# EAGLE schematic PicoBoard (EAGLE 6.5.0)
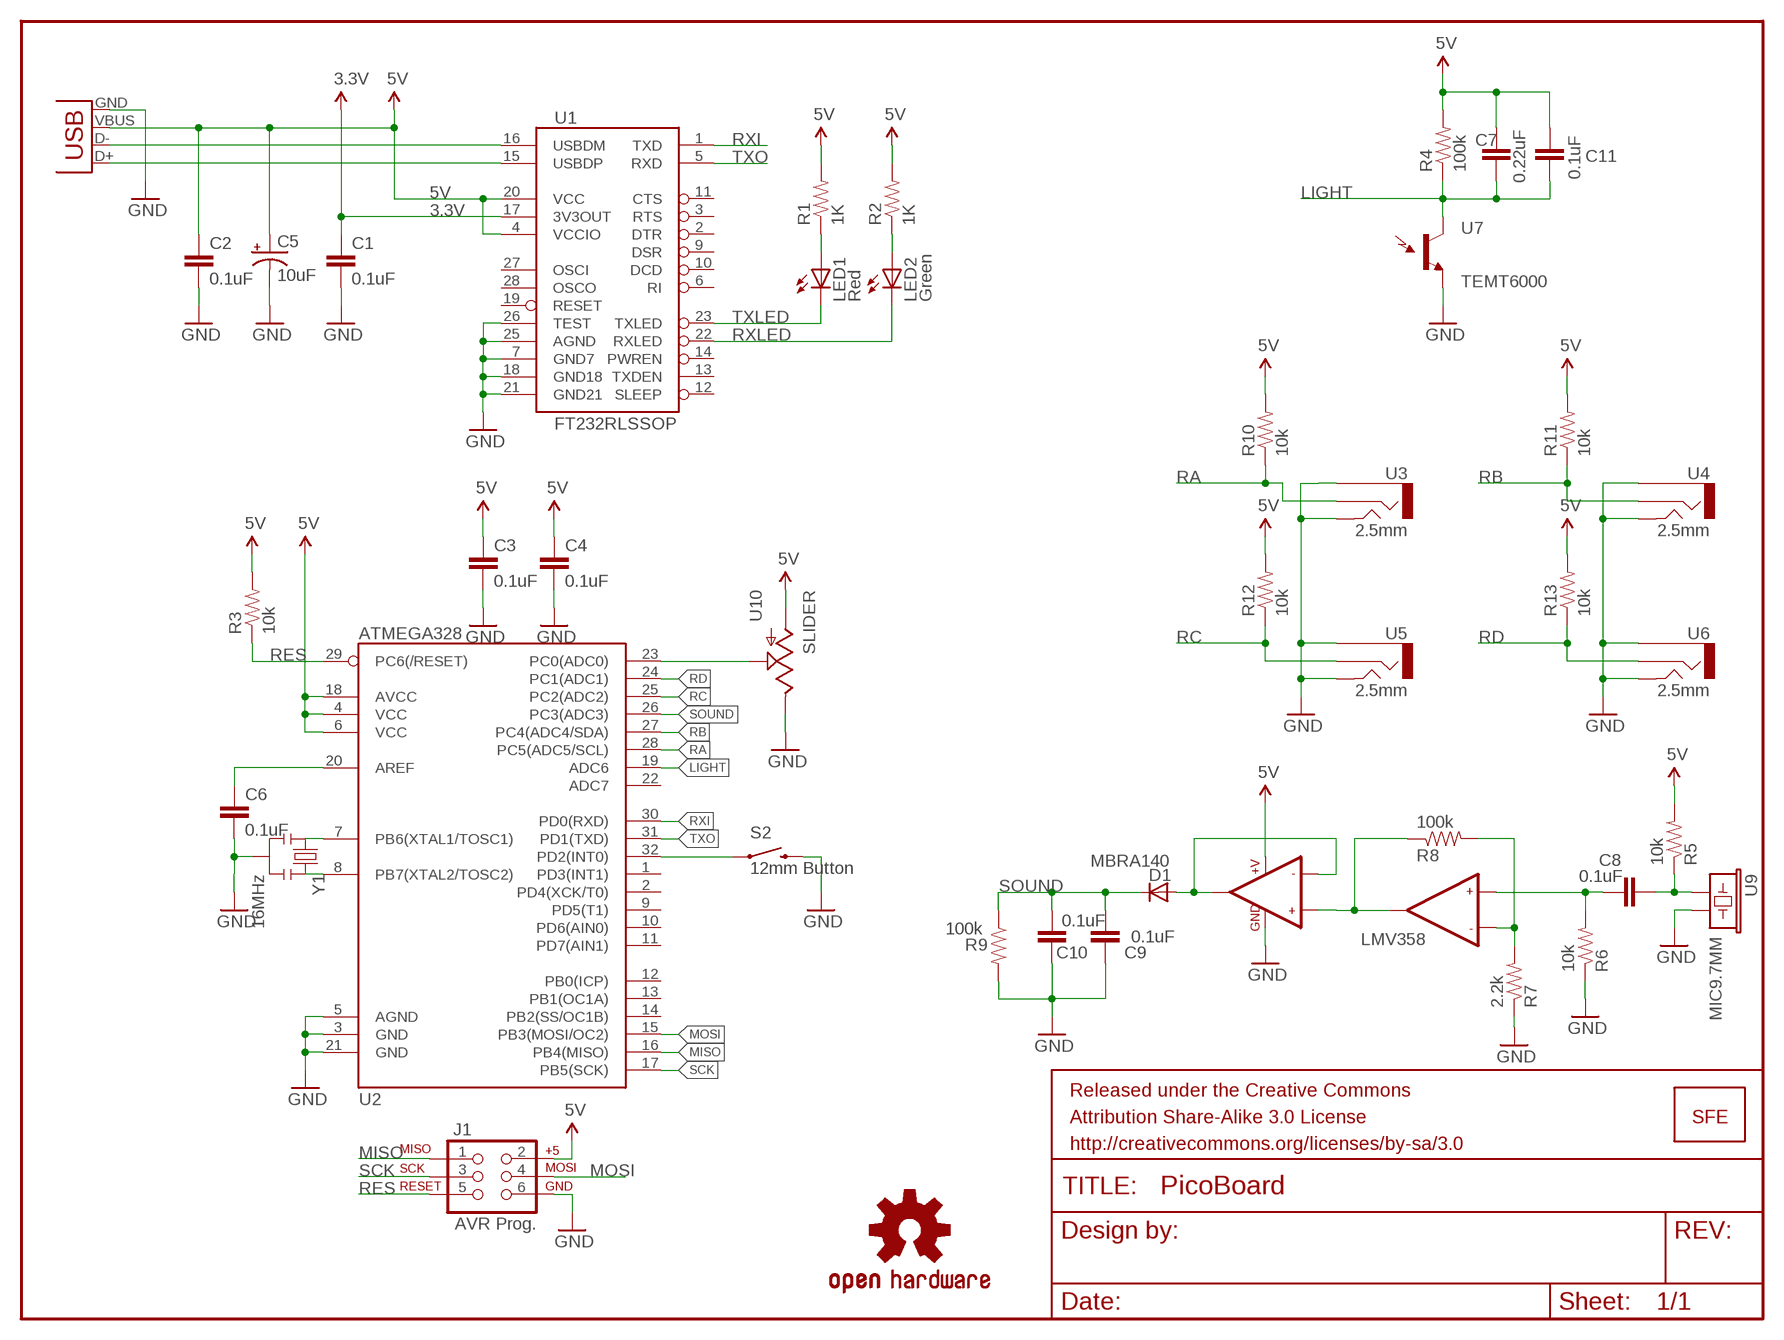
[diagram p0: schematic, sheet 1]

## Parts
C1  0.1uF  CAP0603-CAP  [0603-CAP]
C2  0.1uF  CAP0603-CAP  [0603-CAP]
C3  0.1uF  CAP0603-CAP  [0603-CAP]
C4  0.1uF  CAP0603-CAP  [0603-CAP]
C5  10uF  CAP_POL1206  [EIA3216]
C6  0.1uF  CAP0603-CAP  [0603-CAP]
C7  0.22uF  CAP0603-CAP  [0603-CAP]
C8  0.1uF  CAP0603-CAP  [0603-CAP]
C9  0.1uF  CAP0603-CAP  [0603-CAP]
C10  0.1uF  CAP0603-CAP  [0603-CAP]
C11  0.1uF  CAP0603-CAP  [0603-CAP]
D1  MBRA140  DIODESMA  [SMA-DIODE]
FRAME1  FRAME-LETTER  [CREATIVE_COMMONS]
J1  AVR Prog.  AVR_SPI_PRG_6PTH  [2X3]
JP1  LOGO-SFENEW  [SFE-NEW-WEBLOGO]
LED1  Red  LED0603  [LED-0603]
LED2  Green  LED0603  [LED-0603]
LOGO1  OSHW-LOGOL  [OSHW-LOGO-L]
R1  1K  RESISTOR0603-RES  [0603-RES]
R2  1K  RESISTOR0603-RES  [0603-RES]
R3  10k  RESISTOR0603-RES  [0603-RES]
R4  100k  RESISTOR0603-RES  [0603-RES]
R5  10k  RESISTOR0603-RES  [0603-RES]
R6  10k  RESISTOR0603-RES  [0603-RES]
R7  2.2k  RESISTOR0603-RES  [0603-RES]
R8  100k  RESISTOR0603-RES  [0603-RES]
R9  100k  RESISTOR0603-RES  [0603-RES]
R10  10k  RESISTOR0603-RES  [0603-RES]
R11  10k  RESISTOR0603-RES  [0603-RES]
R12  10k  RESISTOR0603-RES  [0603-RES]
R13  10k  RESISTOR0603-RES  [0603-RES]
S2  12mm Button  SWITCH-MOMENTARY-212MM  [TACTILE-PTH-12MM]
U1  FT232RLSSOP  [SSOP28DB]
U2  ATMEGA328  ATMEGA168  [TQFP32-08]
U3  2.5mm  AUDIO-JACKSMD  [STEREOJACK2.5MM_SMD]
U4  2.5mm  AUDIO-JACKSMD  [STEREOJACK2.5MM_SMD]
U5  2.5mm  AUDIO-JACKSMD  [STEREOJACK2.5MM_SMD]
U6  2.5mm  AUDIO-JACKSMD  [STEREOJACK2.5MM_SMD]
U7  TEMT6000  [TEMT6000-SEN]
U8  LMV358  [SO08]
U9  MIC9.7MM  [MIC-9.7MM]
U10  SLIDER  [SLIDER]
X1  USBSMD  [USB-MINIB]
Y1  16MHz  RESONATORSMD  [RESONATOR-SMD]

## Nets
3.3V [power]: C1.1 U1.17(3V3OUT)
5V: C2.1 C3.1 C4.1 C5.A(+) C7.1 C11.1 J1.2 R1.2 R2.2 R3.2 R4.2 R5.2 R10.2 R11.2 R12.2 R13.2 U1.4(VCCIO) U1.20(VCC) U2.4(VCC) U2.6(VCC) U2.18(AVCC) U8.8(+V) U10.3(A) X1.VBUS
GND [power]: C1.2 C2.2 C3.2 C4.2 C5.C(-) C6.2 C9.1 C10.1 J1.6 R6.1 R7.1 R9.2 S2.3 U1.7(GND7) U1.18(GND18) U1.21(GND21) U1.25(AGND) U1.26(TEST) U2.3(GND) U2.5(AGND) U2.21(GND) U3.1 U3.5 U4.1 U4.5 U5.1 U5.5 U6.1 U6.5 U7.EMITTER(E1) U8.4(GND) U9.2 U10.1(E) X1.GND Y1.2
LIGHT: C7.2 C11.2 R4.1 U2.19(ADC6) U7.COLLECTOR(C1)
MISO: J1.1 U2.16(PB4(MISO))
MOSI: J1.4 U2.15(PB3(MOSI/OC2))
N$1: LED1.A R1.1
N$2: LED2.A R2.1
N$3: R7.2 R8.2 U8.6(-IN2)
N$5: U2.7(PB6(XTAL1/TOSC1)) Y1.1
N$6: U2.8(PB7(XTAL2/TOSC2)) Y1.3
N$7: C6.1 U2.20(AREF)
N$8: S2.1 U2.32(PD2(INT0))
N$9: C8.1 R5.1 U9.1
N$10: U2.23(PC0(ADC0)) U10.2A(S)
N$11: C8.2 R6.2 U8.5(+IN2)
N$13: D1.A U8.1(OUT1) U8.2(-IN1)
N$16: R8.1 U8.3(+IN1) U8.7(OUT2)
RA: R10.1 U2.28(PC5(ADC5/SCL)) U3.4
RB: R11.1 U2.27(PC4(ADC4/SDA)) U4.4
RC: R12.1 U2.25(PC2(ADC2)) U5.4
RD: R13.1 U2.24(PC1(ADC1)) U6.4
RES: J1.5 R3.1 U2.29(PC6(/RESET))
RXI: U1.1(TXD) U2.30(PD0(RXD))
RXLED: LED2.C U1.22(RXLED)
SCK: J1.3 U2.17(PB5(SCK))
SOUND: C9.2 C10.2 D1.C R9.1 U2.26(PC3(ADC3))
TXLED: LED1.C U1.23(TXLED)
TXO: U1.5(RXD) U2.31(PD1(TXD))
USB_D+: U1.15(USBDP) X1.D+
USB_D-: U1.16(USBDM) X1.D-
Unconnected: U1.2(DTR) U1.3(RTS) U1.6(RI) U1.9(DSR) U1.10(DCD) U1.11(CTS) U1.12(SLEEP) U1.13(TXDEN) U1.14(PWREN) U1.19(RESET) U1.27(OSCI) U1.28(OSCO) U2.1(PD3(INT1)) U2.2(PD4(XCK/T0)) U2.9(PD5(T1)) U2.10(PD6(AIN0)) U2.11(PD7(AIN1)) U2.12(PB0(ICP)) U2.13(PB1(OC1A)) U2.14(PB2(SS/OC1B)) U2.22(ADC7)

## Notes on the sheet
- LMV358

## Library data of the parts
C1-C4 C6-C11 = SparkFun:CAP: Capacitor Standard 0603 ceramic capacitor, and 0.1" leaded capacitor.
C5 = SparkFun:CAP_POL: Capacitor Polarized These are standard SMD and PTH capacitors. Normally 10uF, 47uF, and 100uF in electrolytic and tantalum varieties. Always verify the external diameter of the through hole cap, it varies with capacity, voltage, and manufacturer. The EIA devices should be standard.
D1 = SparkFun:DIODE: Diode These are standard reverse protection diodes and small signal diodes. SMA package can handle up to about 1A. SOD-323 can handle about 200mA. What the SOD-323 package when ordering, there are some mfgs out there that are 5-pin packages.
FRAME1 = SparkFun-Aesthetics:FRAME-LETTER: Schematic Frame Standard 8.5x11 US Letter frame
J1 = SparkFun:AVR_SPI_PRG_6: AVR ISP 6 Pin This is the reduced ISP connector for AVR programming. Common on Arduino. This footprint will take up less PCB space and can be used with a 10-pin to 6-pin adapter such as SKU: BOB-08508
JP1 = SparkFun:LOGO-SFE: Spark Fun Electronics PCB Logo This is the standard Spark Fun Electronics PCB logo.
LED1 LED2 = SparkFun:LED: LEDs Standard schematic elements and footprints for 5mm, 3mm, 1206, and 0603 sized LEDs. 5mm - Spark Fun Electronics SKU : COM-00529 (and others)
LOGO1 = SparkFun-Aesthetics:OSHW-LOGO: Open Source Hardware Logo This logo indicates the piece of hardware it is found on incorporates a OSHW license and/or adheres to the definition of open source hardware found here: http://freedomdefined.org/OSHW
R1-R13 = SparkFun:RESISTOR: Resistor Basic schematic elements and footprints for 0603, 1206, and PTH resistors.
S2 = SparkFun:SWITCH-MOMENTARY-2
U1 = SparkFun:FT232RL: USB UART FT232RL 4th Generation USB UART (USB <-> Serial) Controller. Spark Fun Electronics SKU : COM-00650
U2 = SparkFun:ATMEGA168
U3-U6 = SparkFun:AUDIO-JACK: 3.5mm Audio Jack Simple 3.5mm common PCB mount audio jack. SKU: PRT-08032
U7 = SparkFun:TEMT6000: Ambient Light Sensor Simple light detection sensor. Output varies with light intensity input. Spark Fun Electronics SKU : COM-08348
U8 = SparkFun:LMV358
U9 = SparkFun:MIC: Microphone Omni-directional electret microphone. 9.7mm standard diameter.
U10 = SparkFun:SLIDER
X1 = SparkFun:USB: USB Connectors USB-B-PTH is fully proven SKU : PRT-00139 USB-miniB is fully proven SKU : PRT-00587 USB-A-PCB is untested. USB-A-H is throughly reviewed, but untested. Spark Fun Electronics SKU : PRT-00437 USB-B-SMT is throughly reviewed, but untested. Needs silkscreen touching up. USB-A-S has not been used/tested USB-MB-H has not been used/tested
Y1 = SparkFun:RESONATOR: Resonator Small SMD resonator. This is the itty bitty 10/20MHz resonators with built in caps. CSTCE10M0G55 and CSTCE20M0V53. Footprint has been reviewed closely but hasn't been tested yet.

## Net classes
0 default: width 0.203 mm
1 power: width 0.254 mm